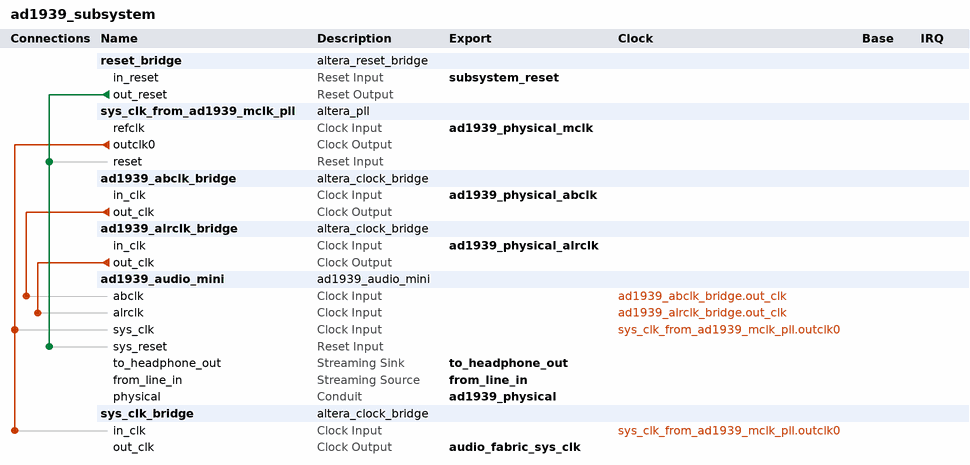
[diagram p0: system contents]
# Platform Designer (Qsys) system ad1939_subsystem, Cyclone V 5CSEBA6U23I7
# Parameters at their usual value, and those the tool derives, are not listed.
package require -exact qsys 21.1
create_system ad1939_subsystem
set_project_property DEVICE_FAMILY {Cyclone V}
set_project_property DEVICE 5CSEBA6U23I7

add_instance reset_bridge altera_reset_bridge 21.1
set_instance_parameter_value reset_bridge ACTIVE_LOW_RESET 0
set_instance_parameter_value reset_bridge SYNCHRONOUS_EDGES none

add_instance sys_clk_from_ad1939_mclk_pll altera_pll 21.1
set_instance_parameter_value sys_clk_from_ad1939_mclk_pll gui_device_speed_grade 2
set_instance_parameter_value sys_clk_from_ad1939_mclk_pll gui_number_of_clocks 1
set_instance_parameter_value sys_clk_from_ad1939_mclk_pll gui_operation_mode direct
set_instance_parameter_value sys_clk_from_ad1939_mclk_pll gui_output_clock_frequency0 98.304
set_instance_parameter_value sys_clk_from_ad1939_mclk_pll gui_pll_mode {Integer-N PLL}
set_instance_parameter_value sys_clk_from_ad1939_mclk_pll gui_reference_clock_frequency 12.288
set_instance_parameter_value sys_clk_from_ad1939_mclk_pll gui_use_locked false

add_instance ad1939_abclk_bridge altera_clock_bridge 21.1
set_instance_parameter_value ad1939_abclk_bridge DERIVED_CLOCK_RATE 0
set_instance_parameter_value ad1939_abclk_bridge EXPLICIT_CLOCK_RATE 12288000

add_instance ad1939_alrclk_bridge altera_clock_bridge 21.1
set_instance_parameter_value ad1939_alrclk_bridge DERIVED_CLOCK_RATE 0
set_instance_parameter_value ad1939_alrclk_bridge EXPLICIT_CLOCK_RATE 192000

add_instance ad1939_audio_mini ad1939_audio_mini 1.0

add_instance sys_clk_bridge altera_clock_bridge 21.1
set_instance_parameter_value sys_clk_bridge DERIVED_CLOCK_RATE 98304000
set_instance_parameter_value sys_clk_bridge EXPLICIT_CLOCK_RATE 98304000

# connections
add_connection ad1939_abclk_bridge.out_clk ad1939_audio_mini.abclk clock
add_connection ad1939_alrclk_bridge.out_clk ad1939_audio_mini.alrclk clock
add_connection sys_clk_from_ad1939_mclk_pll.outclk0 ad1939_audio_mini.sys_clk clock
add_connection sys_clk_from_ad1939_mclk_pll.outclk0 sys_clk_bridge.in_clk clock
add_connection reset_bridge.out_reset ad1939_audio_mini.sys_reset reset
add_connection reset_bridge.out_reset sys_clk_from_ad1939_mclk_pll.reset reset

# exported interfaces
add_interface ad1939_physical conduit end
set_interface_property ad1939_physical EXPORT_OF ad1939_audio_mini.physical
add_interface ad1939_physical_abclk clock sink
set_interface_property ad1939_physical_abclk EXPORT_OF ad1939_abclk_bridge.in_clk
add_interface ad1939_physical_alrclk clock sink
set_interface_property ad1939_physical_alrclk EXPORT_OF ad1939_alrclk_bridge.in_clk
add_interface ad1939_physical_mclk clock sink
set_interface_property ad1939_physical_mclk EXPORT_OF sys_clk_from_ad1939_mclk_pll.refclk
add_interface audio_fabric_sys_clk clock source
set_interface_property audio_fabric_sys_clk EXPORT_OF sys_clk_bridge.out_clk
add_interface from_line_in avalon_streaming source
set_interface_property from_line_in EXPORT_OF ad1939_audio_mini.from_line_in
add_interface subsystem_reset reset sink
set_interface_property subsystem_reset EXPORT_OF reset_bridge.in_reset
add_interface to_headphone_out avalon_streaming sink
set_interface_property to_headphone_out EXPORT_OF ad1939_audio_mini.to_headphone_out

set_interconnect_requirement {$system} qsys_mm.clockCrossingAdapter HANDSHAKE
set_interconnect_requirement {$system} qsys_mm.enableEccProtection FALSE
set_interconnect_requirement {$system} qsys_mm.insertDefaultSlave FALSE
set_interconnect_requirement {$system} qsys_mm.maxAdditionalLatency 1

save_system ad1939_subsystem.qsys
